# Altium schematic sheet CNC Machine Breakout.SchDoc
size C
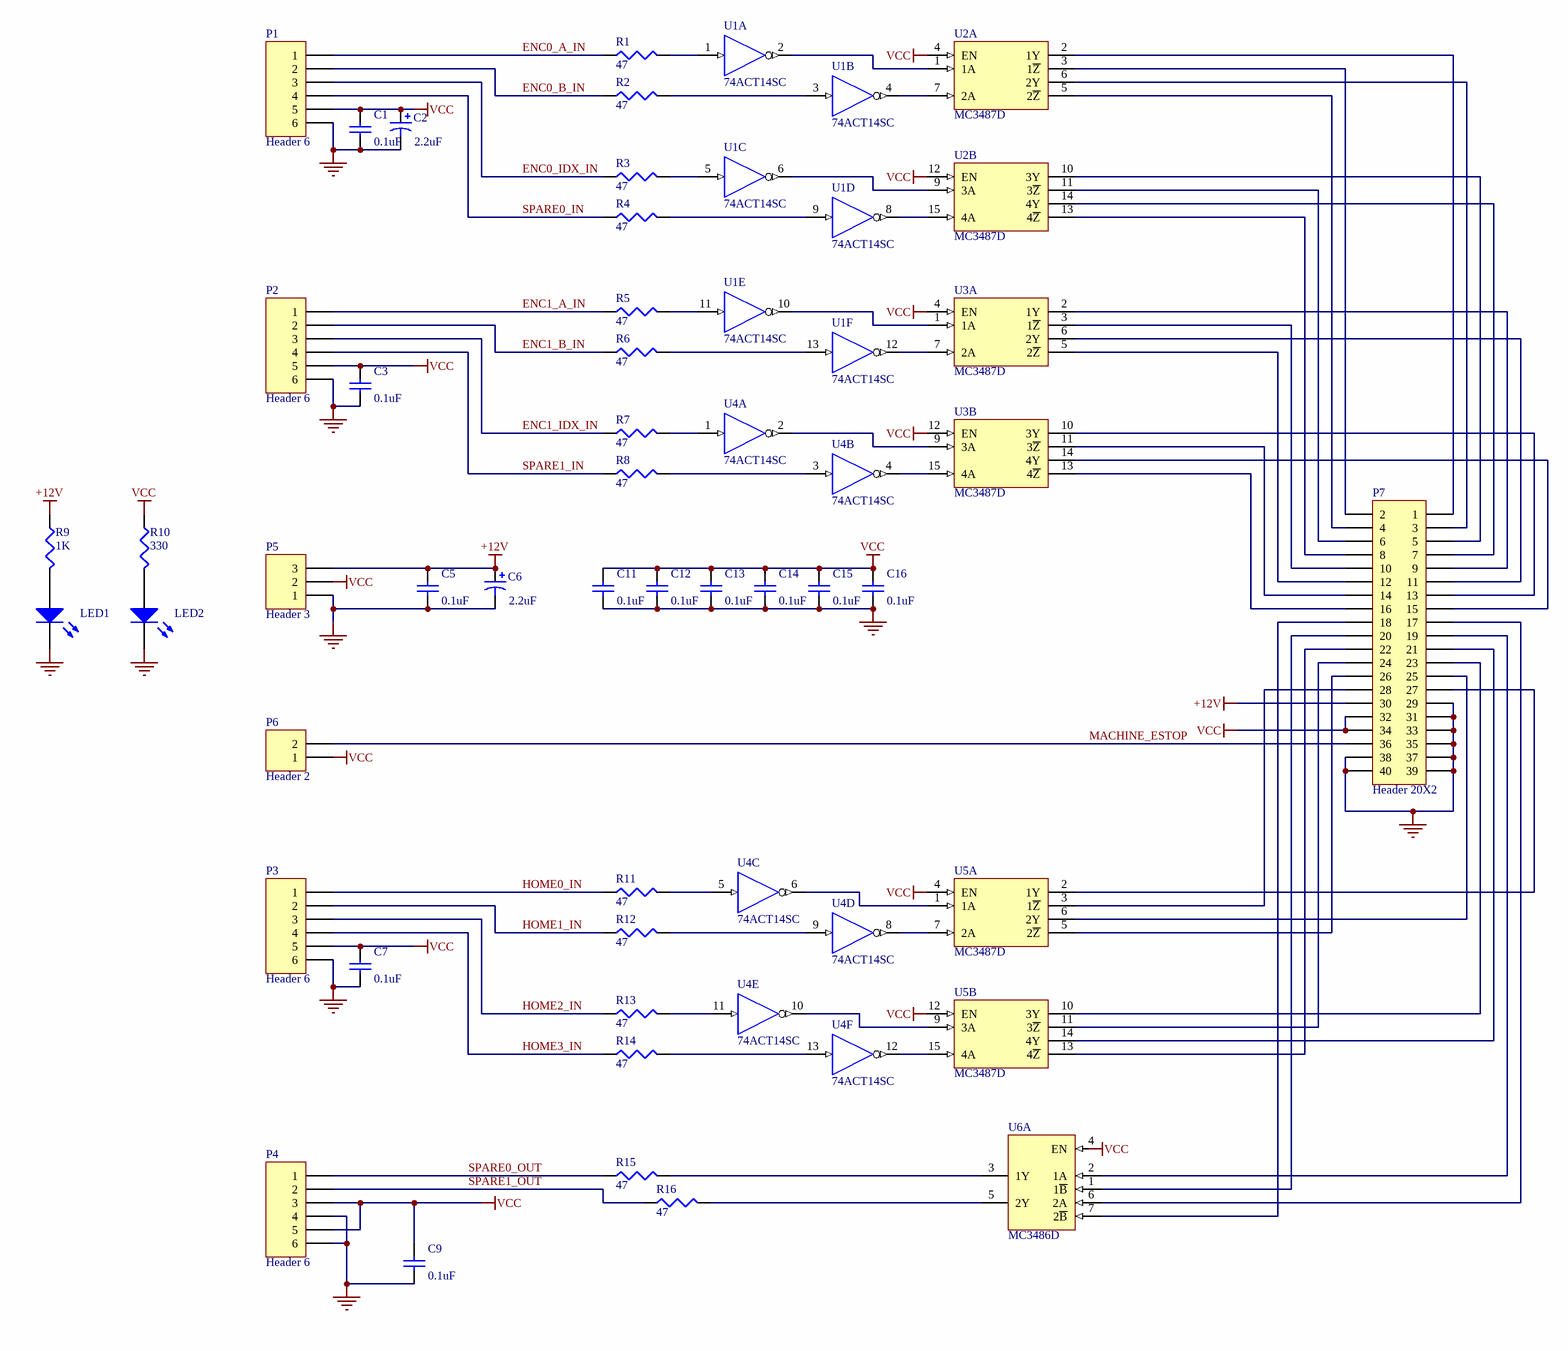
[diagram p0: CNC Machine Breakout.SchDoc]

## Parts
C1  value 0.1uF  [1608[0603]]  (hidden comment: Cap Semi)
C2  value 2.2uF  [Panasonic_HA_B]  (hidden comment: Cap Pol3)
C3  value 0.1uF  [1608[0603]]  (hidden comment: Cap Semi)
C5  value 0.1uF  [1608[0603]]  (hidden comment: Cap Semi)
C6  value 2.2uF  [Panasonic_HA_B]  (hidden comment: Cap Pol3)
C7  value 0.1uF  [1608[0603]]  (hidden comment: Cap Semi)
C9  value 0.1uF  [1608[0603]]  (hidden comment: Cap Semi)
C11  value 0.1uF  [1608[0603]]  (hidden comment: Cap Semi)
C12  value 0.1uF  [1608[0603]]  (hidden comment: Cap Semi)
C13  value 0.1uF  [1608[0603]]  (hidden comment: Cap Semi)
C14  value 0.1uF  [1608[0603]]  (hidden comment: Cap Semi)
C15  value 0.1uF  [1608[0603]]  (hidden comment: Cap Semi)
C16  value 0.1uF  [1608[0603]]  (hidden comment: Cap Semi)
LED1  LED3  [CD2012-0805]  (value not drawn)
LED2  LED3  [CD2012-0805]  (value not drawn)
P1  Header 6  [OSTVN06A150]
P2  Header 6  [OSTVN06A150]
P3  Header 6  [OSTVN06A150]
P4  Header 6  [OSTVN06A150]
P5  Header 3  [OSTVN03A150]
P6  Header 2  [OSTVN02A150]
P7  Header 20X2  [IDC2.54-V40D]
R1  value 47  [J1-0603]  (hidden comment: Res3)
R2  value 47  [J1-0603]  (hidden comment: Res3)
R3  value 47  [J1-0603]  (hidden comment: Res3)
R4  value 47  [J1-0603]  (hidden comment: Res3)
R5  value 47  [J1-0603]  (hidden comment: Res3)
R6  value 47  [J1-0603]  (hidden comment: Res3)
R7  value 47  [J1-0603]  (hidden comment: Res3)
R8  value 47  [J1-0603]  (hidden comment: Res3)
R9  value 1K  [J1-0603]  (hidden comment: Res3)
R10  value 330  [J1-0603]  (hidden comment: Res3)
R11  value 47  [J1-0603]  (hidden comment: Res3)
R12  value 47  [J1-0603]  (hidden comment: Res3)
R13  value 47  [J1-0603]  (hidden comment: Res3)
R14  value 47  [J1-0603]  (hidden comment: Res3)
R15  value 47  [J1-0603]  (hidden comment: Res3)
R16  value 47  [J1-0603]  (hidden comment: Res3)
U1  74ACT14SC  [M14A_N]  (parts A,B,C,D,E,F of 6)
U2  MC3487D  [D016_N]  (parts A,B of 2)
U3  MC3487D  [D016_N]  (parts A,B of 2)
U4  74ACT14SC  [M14A_N]  (parts A,B,C,D,E,F of 6)
U5  MC3487D  [D016_N]  (parts A,B of 2)
U6  MC3486D  [D016_N]  (part A of 2)

## Nets
+12V: C5.1 C6.1 P5.3 P7.30 R9.1
GND: C1.2 C2.2 C3.2 C5.2 C6.2 C7.2 C9.2 C11.2 C12.2 C13.2 C14.2 C15.2 C16.2 LED1.2(K) LED2.2(K) P1.6 P2.6 P3.6 P4.4 P4.6 P5.1 P7.29 P7.31 P7.33 P7.35 P7.37 P7.38 P7.39 P7.40 U1.7(GND) U2.8(GND) U3.8(GND) U4.7(GND) U5.8(GND) U6.8(GND)
VCC: C1.1 C2.1 C3.1 C7.1 C9.1 C11.1 C12.1 C13.1 C14.1 C15.1 C16.1 P1.5 P2.5 P3.5 P4.3 P4.5 P5.2 P6.1 P7.32 P7.34 R10.1 U1.14(VCC) U2.4(EN) U2.12(EN) U2.16(VCC) U3.4(EN) U3.12(EN) U3.16(VCC) U4.14(VCC) U5.4(EN) U5.12(EN) U5.16(VCC) U6.16(VCC)
ENC0_A_IN: P1.1 R1.1
ENC0_B_IN: P1.2 R2.1
ENC0_IDX_IN: P1.3 R3.1
ENC1_A_IN: P2.1 R5.1
ENC1_B_IN: P2.2 R6.1
ENC1_IDX_IN: P2.3 R7.1
HOME0_IN: P3.1 R11.1
HOME1_IN: P3.2 R12.1
HOME2_IN: P3.3 R13.1
HOME3_IN: P3.4 R14.1
MACHINE_ESTOP: P6.2 P7.36
SPARE0_IN: P1.4 R4.1
SPARE0_OUT: P4.1 R15.1
SPARE1_IN: P2.4 R8.1
SPARE1_OUT: P4.2 R16.1
NetLED1_1: LED1.1(A) R9.2
NetLED2_1: LED2.1(A) R10.2
NetP7_1: P7.1 U2.2(1Y)
NetP7_2: P7.2 U2.3(1~{Z})
NetP7_3: P7.3 U2.6(2Y)
NetP7_4: P7.4 U2.5(2~{Z})
NetP7_5: P7.5 U2.10(3Y)
NetP7_6: P7.6 U2.11(3~{Z})
NetP7_7: P7.7 U2.14(4Y)
NetP7_8: P7.8 U2.13(4~{Z})
NetP7_9: P7.9 U3.2(1Y)
NetP7_10: P7.10 U3.3(1~{Z})
NetP7_11: P7.11 U3.6(2Y)
NetP7_12: P7.12 U3.5(2~{Z})
NetP7_13: P7.13 U3.10(3Y)
NetP7_14: P7.14 U3.11(3~{Z})
NetP7_15: P7.15 U3.14(4Y)
NetP7_16: P7.16 U3.13(4~{Z})
NetP7_17: P7.17 U6.6(2A)
NetP7_18: P7.18 U6.7(2~{B})
NetP7_19: P7.19 U6.2(1A)
NetP7_20: P7.20 U6.1(1~{B})
NetP7_21: P7.21 U5.14(4Y)
NetP7_22: P7.22 U5.13(4~{Z})
NetP7_23: P7.23 U5.10(3Y)
NetP7_24: P7.24 U5.11(3~{Z})
NetP7_25: P7.25 U5.6(2Y)
NetP7_26: P7.26 U5.5(2~{Z})
NetP7_27: P7.27 U5.2(1Y)
NetP7_28: P7.28 U5.3(1~{Z})
NetR1_2: R1.2 U1.1(I)
NetR2_2: R2.2 U1.3(I)
NetR3_2: R3.2 U1.5(I)
NetR4_2: R4.2 U1.9(I)
NetR5_2: R5.2 U1.11(I)
NetR6_2: R6.2 U1.13(I)
NetR7_2: R7.2 U4.1(I)
NetR8_2: R8.2 U4.3(I)
NetR11_2: R11.2 U4.5(I)
NetR12_2: R12.2 U4.9(I)
NetR13_2: R13.2 U4.11(I)
NetR14_2: R14.2 U4.13(I)
NetR15_2: R15.2 U6.3(1Y)
NetR16_2: R16.2 U6.5(2Y)
NetU1_2: U1.2(~{O}) U2.1(1A)
NetU1_4: U1.4(~{O}) U2.7(2A)
NetU1_6: U1.6(~{O}) U2.9(3A)
NetU1_8: U1.8(~{O}) U2.15(4A)
NetU1_10: U1.10(~{O}) U3.1(1A)
NetU1_12: U1.12(~{O}) U3.7(2A)
NetU3_9: U3.9(3A) U4.2(~{O})
NetU3_15: U3.15(4A) U4.4(~{O})
NetU4_6: U4.6(~{O}) U5.1(1A)
NetU4_8: U4.8(~{O}) U5.7(2A)
NetU4_10: U4.10(~{O}) U5.9(3A)
NetU4_12: U4.12(~{O}) U5.15(4A)

Not connected (* = marked no-connect by the designer): U6 4(EN)

## Notes on the sheet
- Labels drawn without touching a wire or pin: VCC
- http://www.tangentaudio.com/
- Tangent Audio

## Library data of the parts
C1 C3 C5 C7 C9 C11-C16 = Cap Semi: Capacitor (Semiconductor SIM Model); Published: 8-Jun-2000; LatestRevisionDate: 17-Jul-2002; LatestRevisionNote: Re-released for DXP Platform.; PackageReference: C1206; Publisher: Altium Limited
C2 C6 = Cap Pol3: Polarized Capacitor (Surface Mount); Published: 8-Jun-2000; LatestRevisionDate: 17-Jul-2002; LatestRevisionNote: Re-released for DXP Platform.; PackageReference: C0805; Publisher: Altium Limited
LED1 LED2 = LED3: Typical BLUE SiC LED; Published: 8-Jun-2000; LatestRevisionDate: 17-Dec-2003; LatestRevisionNote: PCB Footprint replaced.; DatasheetDocument: 16-Apr-2002; PackageDocument: 16-Apr-2002; PackageReference: 3.5X2.8X1.9; Publisher: Altium Limited
P1-P4 = Header 6: Header, 6-Pin; LatestRevisionDate: 17-Jul-2002; LatestRevisionNote: Re-released for DXP Platform.; Publisher: Altium Limited
P5 = Header 3: Header, 3-Pin; LatestRevisionDate: 17-Jul-2002; LatestRevisionNote: Re-released for DXP Platform.; Publisher: Altium Limited
P6 = Header 2: Header, 2-Pin; LatestRevisionDate: 17-Jul-2002; LatestRevisionNote: Re-released for DXP Platform.; Publisher: Altium Limited
P7 = Header 20X2: Header, 20-Pin, Dual row; LatestRevisionDate: 17-Jul-2002; LatestRevisionNote: Re-released for DXP Platform.; Publisher: Altium Limited
R1-R16 = Res3: Resistor; Published: 8-Jun-2000; LatestRevisionDate: 04-Mar-2005; LatestRevisionNote: PCB Footprint replaced.; PackageReference: J1-0603; Publisher: Altium Limited
U1 U4 = 74ACT14SC: Hex Inverter with Schmitt Trigger Input; Published: 17-Jul-2002; LatestRevisionDate: 13-Apr-2006; LatestRevisionNote: IPC-7351 Footprint Added.; DatasheetVersion: Dec-1999; PackageVersion: 2000; PackageReference: M14A; Publisher: Altium Limited; PackageDescription: 14-Pin Small Outline Integrated Circuit 1.27 mm Pitch; Code_IPC: SOIC127P600-14; ComponentLink1Description: Manufacturer Link; ComponentLink1URL: http://www.fairchildsemi.com/; ComponentLink2Description: Datasheet; ComponentLink2URL: http://www.fairchildsemi.com/ds/74%2F74AC14.pdf
U2 U3 U5 = MC3487D: Quadruple Differential Line Driver with 3-State Output; Published: 15-May-2002; LatestRevisionDate: 13-Apr-2006; LatestRevisionNote: IPC-7351 Footprint Added.; DatasheetVersion: Sep-1986; PackageVersion: Jan-1998; PackageReference: D016; Publisher: Altium Limited; PackageDescription: 16-Pin Small Outline Integrated Circuit 1.27 mm Pitch; Code_IPC: SOIC127P600-16; ComponentLink1Description: Manufacturer Link; ComponentLink1URL: http://www.ti.com/; ComponentLink2Description: Datasheet; ComponentLink2URL: http://www-s.ti.com/sc/ds/mc3487.pdf
U6 = MC3486D: Quadruple Line Receiver with 3-State Output; Published: 15-May-2002; LatestRevisionDate: 13-Apr-2006; LatestRevisionNote: IPC-7351 Footprint Added.; DatasheetVersion: Sep-1986; PackageVersion: Jan-1998; PackageReference: D016; Publisher: Altium Limited; PackageDescription: 16-Pin Small Outline Integrated Circuit 1.27 mm Pitch; Code_IPC: SOIC127P600-16; ComponentLink1Description: Manufacturer Link; ComponentLink1URL: http://www.ti.com/; ComponentLink2Description: Datasheet; ComponentLink2URL: http://www-s.ti.com/sc/ds/mc3486.pdf